# EAGLE design LB_i14_BENDSENSOR-v03(rev2) (EAGLE 6.6.0)
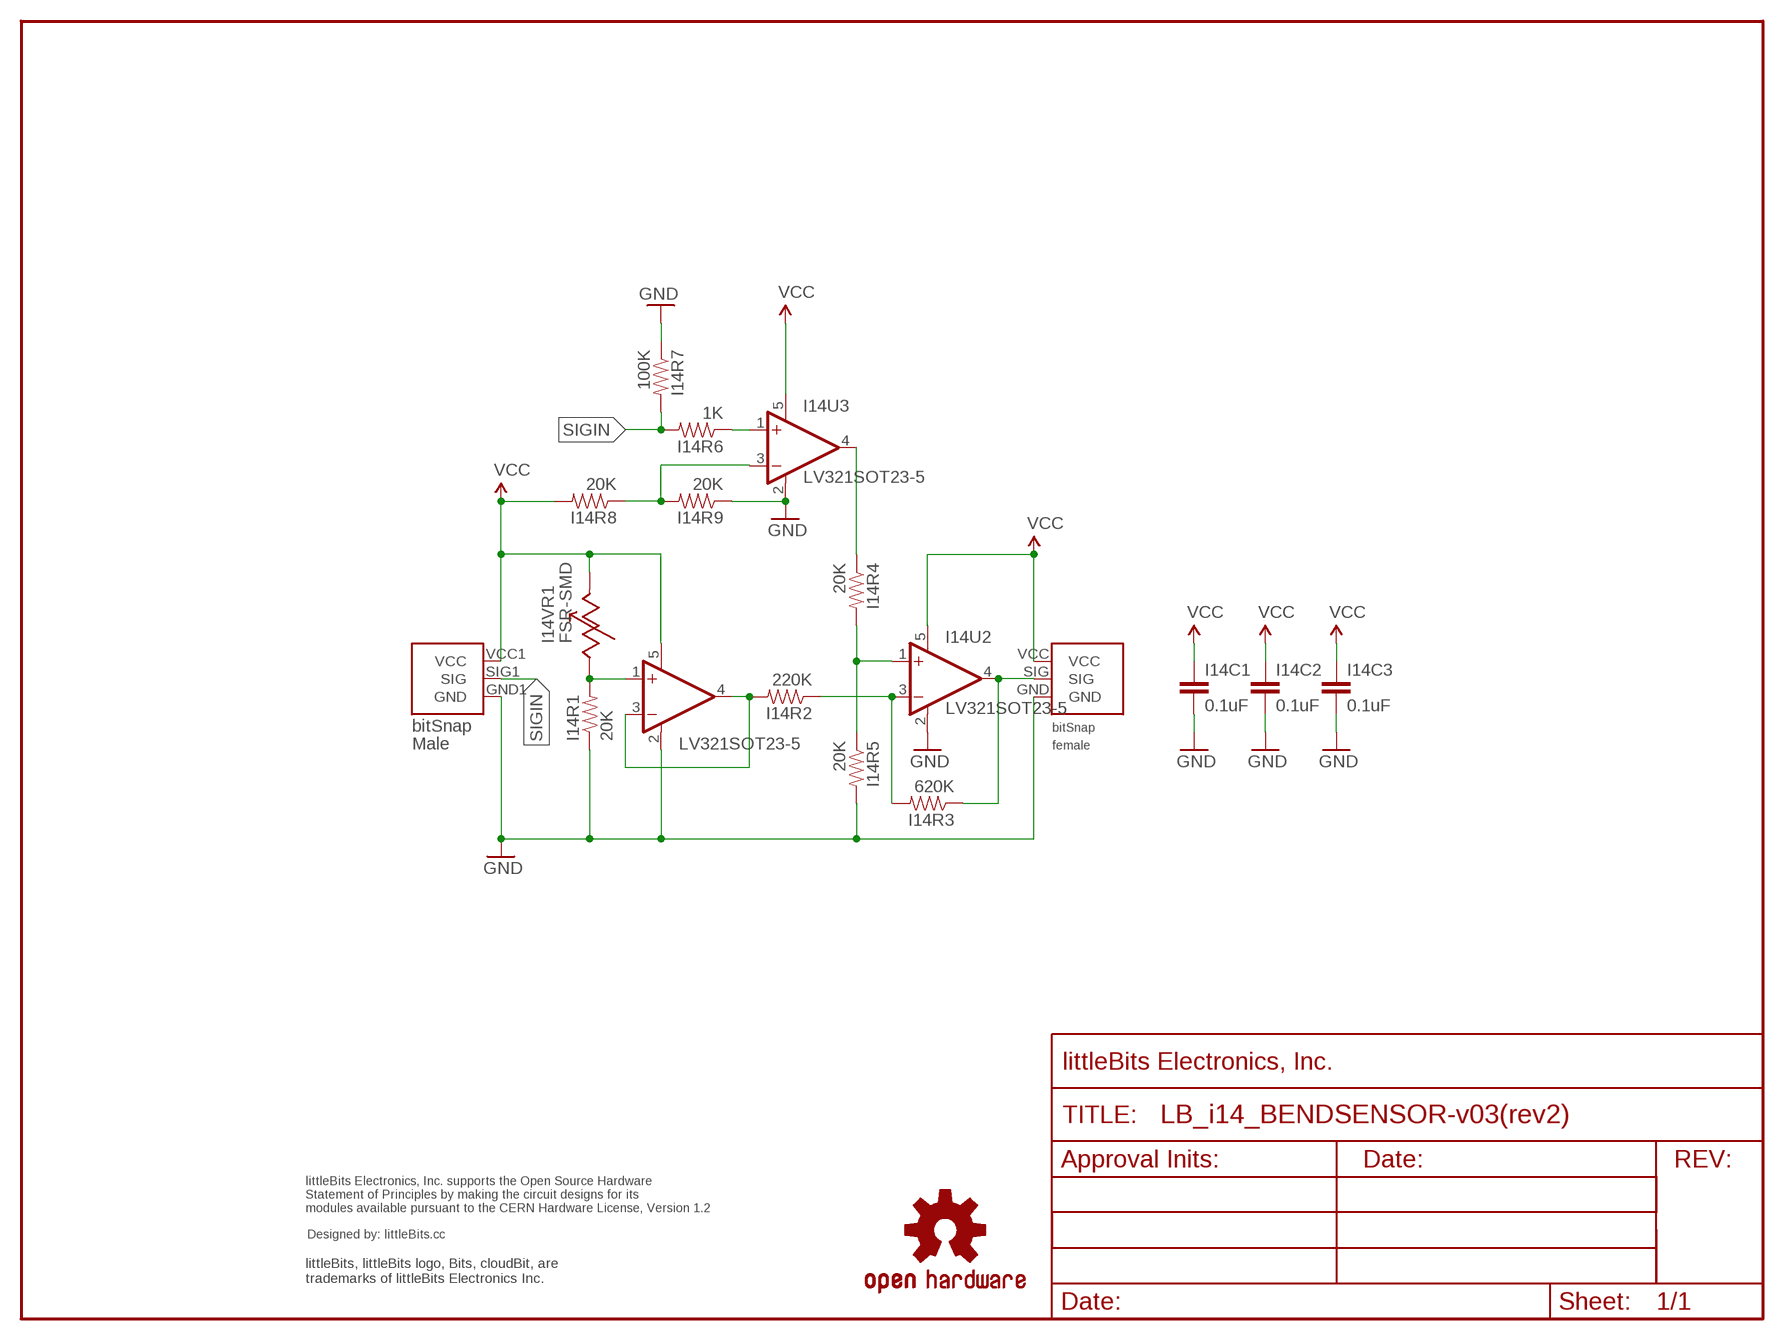
[diagram p0: schematic, sheet 1]

## Parts
I14BSM  BITSNAP_V03_MALE  [BITSNAP_V03_MALE]
I14C1  0.1uF  CAP0603-CAP  [0603-CAP]
I14C2  0.1uF  CAP0603-CAP  [0603-CAP]
I14C3  0.1uF  CAP0603-CAP  [0603-CAP]
I14R1  20K  RESISTOR0603-RES  [0603-RES]
I14R2  220K  RESISTOR0603-RES  [0603-RES]
I14R3  620K  RESISTOR0603-RES  [0603-RES]
I14R4  20K  RESISTOR0603-RES  [0603-RES]
I14R5  20K  RESISTOR0603-RES  [0603-RES]
I14R6  1K  RESISTOR0603-RES  [0603-RES]
I14R7  100K  RESISTOR0603-RES  [0603-RES]
I14R8  20K  RESISTOR0603-RES  [0603-RES]
I14R9  20K  RESISTOR0603-RES  [0603-RES]
I14U1  LV321SOT23-5  [SOT23-5]
I14U2  LV321SOT23-5  [SOT23-5]
I14U3  LV321SOT23-5  [SOT23-5]
I14VR1  FSR-SMD  [FSR-SMD]
U$1  OSHW-LOGOL  [OSHW-LOGO-L]
U$2  FRAME-LETTER-OHWOHW  [FABDWG01-OHW]
U$3  OSHWCREDIT  [OSHWCREDIT]
U$4I14BSF  BITSNAP_V03_FEMALE  [BITSNAP_V03_FEMALE]

## Nets
GND: I14BSM.GND1(GND) I14C1.2 I14C2.2 I14C3.2 I14R1.1 I14R5.2 I14R7.1 I14R9.1 I14U1.2(V-) I14U2.2(V-) I14U3.2(V-) U$4I14BSF.GND
N$1: I14R1.2 I14U1.1(+IN) I14VR1.2(A)
N$2: I14R3.1 I14U2.4(OUT) U$4I14BSF.SIG
N$3: I14R2.1 I14R3.2 I14U2.3(-IN)
N$4: I14R4.2 I14R5.1 I14U2.1(+IN)
N$5: I14R4.1 I14U3.4(OUT)
N$6: I14R2.2 I14U1.3(-IN) I14U1.4(OUT)
N$7: I14R8.1 I14R9.2 I14U3.3(-IN)
N$8: I14R6.1 I14U3.1(+IN)
SIGIN: I14BSM.SIG1(SIG) I14R6.2 I14R7.2
VCC: I14BSM.VCC1(VCC) I14C1.1 I14C2.1 I14C3.1 I14R8.2 I14U1.5(V+) I14U2.5(V+) I14U3.5(V+) I14VR1.1 U$4I14BSF.VCC

## Library data of the parts
I14BSM = bitSnap:BITSNAP_V03_MALE
I14C1-I14C3 = SparkFun:CAP: Capacitor Standard 0603 ceramic capacitor, and 0.1" leaded capacitor.
I14R1-I14R9 = SparkFun:RESISTOR: Resistor Basic schematic elements and footprints for 0603, 1206, and PTH 1/10th watt (small) resistors.
I14U1-I14U3 = LITTLEBITS:LV321
I14VR1 = LITTLEBITS:FSR-SMD
U$1 = SparkFun_NEW:OSHW-LOGO: Open Source Hardware Logo This logo indicates the piece of hardware it is found on incorporates a OSHW license and/or adheres to the definition of open source hardware found here: http://freedomdefined.org/OSHW
U$2 = LITTLEBITS:FRAME-LETTER-OHW
U$3 = LITTLEBITS:OSHWCREDIT
U$4I14BSF = bitSnap:BITSNAP_V03_FEMALE

## Board
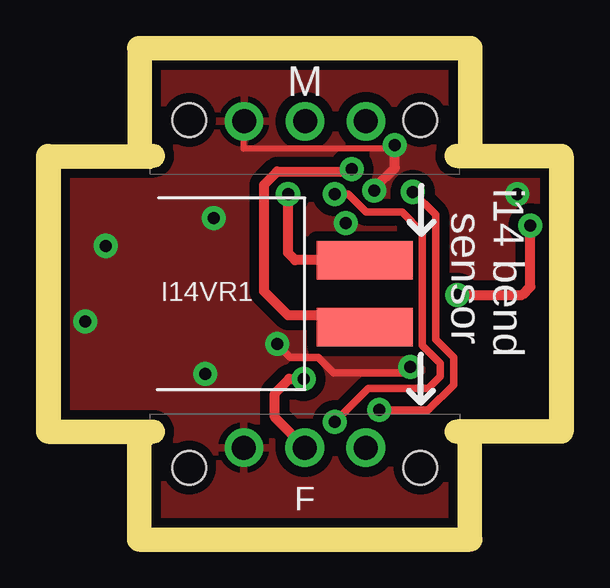
[diagram p1: board, top side]
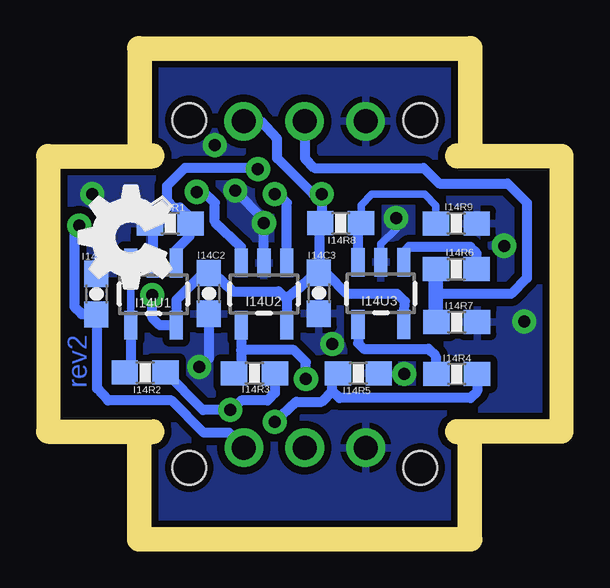
[diagram p2: board, bottom side, seen from below]

Size 20.4 x 19.5 mm. Coordinates in mm from the lower left corner, seen from the top.
Outline: 0,15 0,4.5
Outline: 20.4,4.5 20.4,15
Copper layers (1*16): Top 0.035mm / dielectric 1.5mm / Bottom 0.035mm
Design rules "default": minimum track width 8mil, minimum drill 20mil, track to track 8mil, track to pad 8mil, pad to pad 8mil, via to via 8mil, smd to smd 8mil, copper to edge 10mil, drill to drill 8mil, minimum pad ring 12mil, minimum via ring 10mil, stop-mask expansion 4mil, vias tented up to drill 25mil, thermal gap 10mil
Milling: 2 lines

### Footprints (pad centres in the part's own frame; a part is rotated, then mirrored left to right if it is on the bottom)
BITSNAP_V03_MALE = drill 1: GND1 8.98,2.56; SIG1 6.44,2.56; VCC1 3.9,2.56 | hole 1.4: 11.27,2.5; 1.63,2.5
0603-CAP = smd 1.1 x 1: 1 -0.85,0; 2 0.85,0
0603-RES = smd 1.1 x 1: 1 -0.85,0; 2 0.85,0
SOT23-5 = smd 0.55 x 1.2: 1 -0.95,-1.3; 2 0,-1.3; 3 0.95,-1.3; 4 0.95,1.3; 5 -0.95,1.3
FSR-SMD = smd 1.6 x 4: 1 0.6,2.2; 2 3.4,2.2
BITSNAP_V03_FEMALE = drill 1: GND 3.91,3.33; SIG 6.45,3.33; VCC 8.99,3.33 | hole 1.4: 1.63,2.5; 11.27,2.5

### Placement (x,y rotation side)
I14BSM  16.65,19.5 180 top
I14C1  18.88,9.74 90 bottom
I14C2  14.2,9.77 270 bottom
I14C3  9.62,9.77 270 bottom
I14R1  15.81,12.68 0 bottom
I14R2  16.85,6.46 180 bottom
I14R3  12.3,6.44 0 bottom
I14R4  3.87,6.4 0 bottom
I14R5  7.97,6.42 0 bottom
I14R6  3.89,10.78 180 bottom
I14R7  3.87,8.56 180 bottom
I14R8  8.71,12.69 180 bottom
I14R9  3.89,12.68 180 bottom
I14U1  16.51,9.73 180 bottom
I14U2  11.9,9.74 180 bottom
I14U3  7.03,9.76 180 bottom
I14VR1  10.5,11.75 270 top
U$1  -33.98,-65.92 0 top  (outside the outline)
U$2  0,0 0 top
U$3  -93.8,-60.6 0 top  (outside the outline)
U$4I14BSF  3.75,0 0 top
U$7  [OSHW_FILLX150_NOTEXT]  15.78,9.15 0 top

### Tracks (layer width: path | path; a pad name or v marks a point on that pad's centre or on a via)
GND  (via drill 0.5)
  Top 0.254: 13.75,15.8 7.65,15.8 7.65,16.92 I14BSM.GND1
  Top 0.305: v14.6,6.7 14.4,6.45 11.4,6.45 10.75,7.1 9.6,7.1 v9.05,7.65
  Top 0.406: v13.1,14.05 13.1,14.15 13.95,15 13.95,15.9 13.9,15.95 v13.95,15.95 13.75,15.8
  Bottom 0.305: I14U3.2 7.03,11.82 6.4,12.45 v6.4,12.9
  Bottom 0.406: I14U1.2 16.51,12.54 I14R1.1 | I14C2.2 14.2,7.05 v14.6,6.7 | I14U2.2 11.9,12.85 v13.1,14.05
  other vias: 6.05,6.4 1.05,8.6 19.05,13.9 1.9,11.75 11.9,12.7
  pour Top (isolate 0.406): 0.2,19.3 20.22,19.3 20.22,0.2 0.2,0.2
  pour Bottom (isolate 0.305): 0.2,19.3 20.22,19.3 20.22,0.2 0.2,0.2
N$1  (via drill 0.5)
  Top 0.406: 11,8.85 9.5,8.85 8.5,9.85 8.5,14.3 9.05,14.85 12.1,14.85 v12.15,14.95
  Top 0.61: I14VR1.2 11,8.35 11,8.85
  Bottom 0.406: 15.56,11.34 I14U1.1 15.56,11.59 15,12.15 15,12.64 I14R1.2 | I14R1.2 | I14R1.2 | v12.15,14.95 12.3,15.1 12.4,15 15.2,15 15.95,14.25 15.95,13.65 15.65,13.35 15.4,13.35 14.95,12.9 I14R1.2
N$2  (via drill 0.5)
  Top 0.406: U$4I14BSF.SIG 10.2,3.5 10.05,3.5 8.95,4.6 8.95,5.6 9.55,6.2 v10.15,6.2
  Bottom 0.406: I14U2.4 12.85,7.4 | 12.85,7.4 12.85,6.73 I14R3.1 | v10.15,6.2 10.15,6.9 10.65,7.4 12.85,7.4
N$3  (via drill 0.5)
  Top 0.305: v14.7,14 15.65,13.05 15.65,7.85 16.4,7.1 16.4,5.95 15.35,4.9 v13.3,4.9
  Bottom 0.406: I14R3.2 11.45,5.61 11.75,5.3 12.85,5.3 13.3,4.85 v13.3,4.9 14.45,4.9 I14R2.1 | I14U2.3 12.85,11.65 12.85,11.7 13.95,12.75 13.95,13.55 14.4,14 v14.7,14
N$4  (via drill 0.5)
  Top 0.305: v11.45,13.9 12,13.9 12.75,13.15 14.25,13.15 15.1,12.3 15.1,7.6 15.85,6.85 15.85,6.3 15.35,5.8 12.85,5.8 v11.45,4.4
  Bottom 0.406: I14R4.2 3.02,5.68 3.3,5.4 8.75,5.4 9.05,5.7 | 9.05,5.7 9.05,6.4 I14R5.1 | I14U2.1 10.95,13.55 11.3,13.9 v11.45,13.9 | v11.45,4.4 10.55,5.25 9.5,5.25 9.05,5.7
N$5
  Bottom 0.406: I14U3.4 7.98,7.68 7.75,7.45 5.05,7.45 4.75,7.15 4.75,6.43 I14R4.1
N$6
  Bottom 0.305: I14U1.3 I14U1.4
  Bottom 0.406: I14U1.4 17.46,6.57 I14R2.2
N$7
  Bottom 0.305: I14R9.2 4.74,13.44 5.2,13.9 7.4,13.9 7.85,13.45 I14R8.1
  Bottom 0.406: I14U3.3 7.98,12.27 I14R8.1
  Bottom 0.61: 7.8,12.68 I14R8.1
N$8
  Bottom 0.406: I14R6.1 3.04,11.44 3.3,11.7 5.85,11.7 6,11.55 6.1,11.45 I14U3.1
SIGIN
  Bottom 0.406: I14BSM.SIG1 10.2,15.4 9.8,15 5.25,15 4.6,14.35 1.75,14.35 0.95,13.55 0.95,10.4 1.6,9.75 4.69,9.75 4.74,9.7
  Bottom 0.61: I14R6.2 4.74,9.7 4.74,8.73 I14R7.2
VCC  (via drill 0.5)
  Top 0.406: I14VR1.1 9.8,11.15 9.5,11.45 v9.5,13.9 | v16.55,9.7 19.25,9.7 19.6,10.05 v19.6,12.6
  Bottom 0.406: I14C3.1 9.6,10.64 9.6,11.45 9.61,12.64 I14R8.2 9.5,12.7 v9.5,13.9 9.85,13.9 11.35,15.4 11.35,16.2 12.04,16.94 I14BSM.VCC1 | I14U3.5 6.03,9.43 6.35,9.75 8.45,9.75 9.25,10.55 9.54,10.55 I14C3.1 | 10.95,9.55 11.3,9.85 13.2,9.85 14.02,10.62 I14C2.1 14.43,10.62 15.55,9.5 15.55,8.44 I14U1.5 16.23,8.43 16.55,8.75 v16.55,9.7 | 10.95,9.55 I14U2.5 | I14U2.5 | I14C3.1 9.62,10.53 10.05,10.35 10.6,9.85 10.95,9.55 | U$4I14BSF.VCC 13.35,3.95 14.4,3.95 15.75,5.3 18.4,5.3 18.85,5.8 18.85,8.86 I14C1.1 18.89,8.9 19.5,8.9 19.8,9.2 19.8,12.4 v19.6,12.6

### Text on the board
Bottom: rev2
tPlace: i14 bend | sensor
tNames: I14VR1
Milling: 1mm DIA. ROUTER PATH
Reference: SMALL